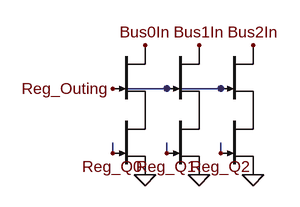
[diagram p0: schematic Bus Buffer 3 Bits.asc]
Bus Buffer 3 Bits.asc, the LTspice schematic file:
Version 4.1
SHEET 1 109444 42780
WIRE -4096 -1024 -4176 -1024
WIRE -4016 -1024 -4096 -1024
WIRE -4000 -1024 -4016 -1024
WIRE -4176 -928 -4176 -944
WIRE -4096 -928 -4096 -944
WIRE -4016 -928 -4016 -944
FLAG -4128 -896 0
FLAG -4128 -1088 Bus0In
FLAG -4176 -1024 Reg_Outing
FLAG -4048 -896 0
FLAG -4048 -1088 Bus1In
FLAG -3968 -896 0
FLAG -3968 -1088 Bus2In
FLAG -4176 -928 Reg_Q0
FLAG -4096 -928 Reg_Q1
FLAG -4016 -928 Reg_Q2
SYMBOL njf -4176 -992 R0
WINDOW 0 56 32 Invisible 2
WINDOW 3 56 72 Invisible 2
SYMATTR InstName J_A23
SYMATTR Value DR
SYMBOL njf -4176 -1088 R0
WINDOW 0 56 32 Invisible 2
WINDOW 3 56 72 Invisible 2
SYMATTR InstName J_A24
SYMATTR Value DR
SYMBOL njf -4096 -992 R0
WINDOW 0 56 32 Invisible 2
WINDOW 3 56 72 Invisible 2
SYMATTR InstName J_A17
SYMATTR Value DR
SYMBOL njf -4096 -1088 R0
WINDOW 0 56 32 Invisible 2
WINDOW 3 56 72 Invisible 2
SYMATTR InstName J_A18
SYMATTR Value DR
SYMBOL njf -4016 -992 R0
WINDOW 0 56 32 Invisible 2
WINDOW 3 56 72 Invisible 2
SYMATTR InstName J_A21
SYMATTR Value DR
SYMBOL njf -4016 -1088 R0
WINDOW 0 56 32 Invisible 2
WINDOW 3 56 72 Invisible 2
SYMATTR InstName J_A22
SYMATTR Value DR

The netlist it stands for:
* Bus Buffer 3 Bits.asc
J_A23 P001 Reg_Q0 0 DR
J_A24 Bus0In Reg_Outing P001 DR
J_A17 P002 Reg_Q1 0 DR
J_A18 Bus1In Reg_Outing P002 DR
J_A21 P003 Reg_Q2 0 DR
J_A22 Bus2In Reg_Outing P003 DR
.model NJF NJF
.model PJF PJF
.lib standard.jft
.backanno
.end